# Altium project modFOC-MCU.PrjPcb
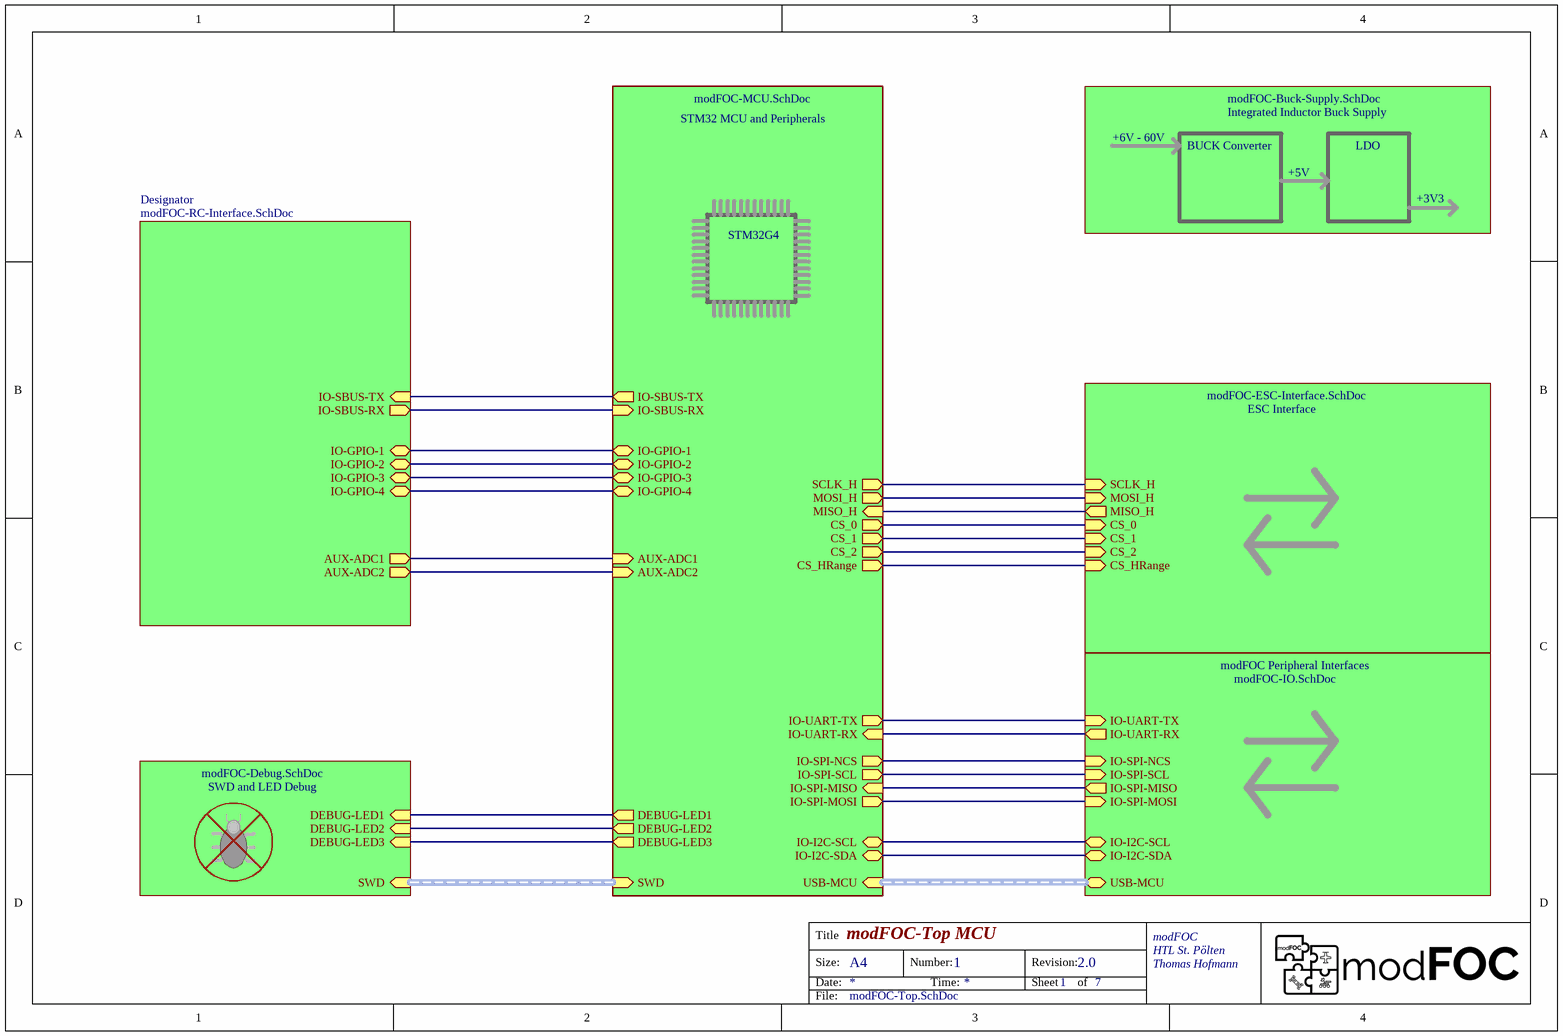
[diagram p0: modFOC-Top.SchDoc]
7 sheets, 106 parts. Net scope: hierarchical (ports join the sheet entries above them; power ports are global).
Board file: modFOC-MCU.PcbDoc
Sheets:
  modFOC-Top.SchDoc
    modFOC Peripheral Interfaces = modFOC-IO.SchDoc
    STM32 MCU and Peripherals = modFOC-MCU.SchDoc
    Integrated Inductor Buck Supply = modFOC-Buck-Supply.SchDoc
    SWD and LED Debug = modFOC-Debug.SchDoc
    ESC Interface = modFOC-ESC-Interface.SchDoc
    Designator = modFOC-RC-Interface.SchDoc

## Sheet modFOC-Top.SchDoc: modFOC-Top MCU
size A4; Author: Thomas Hofmann; CompanyName: HTL St. Pölten; Organization: Altium Limited; Address1: modFOC; Address2: Frenchs Forest; Address3: NSW; Address4: Australia 2086; DocumentNumber: 1; Revision: 2.0; SheetNumber: 1; SheetTotal: 7

### Sub-sheets
Designator = modFOC-RC-Interface.SchDoc: IO-SBUS-TX (in), IO-SBUS-RX (out), IO-GPIO-1 (bidir), AUX-ADC2 (out), IO-GPIO-4 (bidir), AUX-ADC1 (out), IO-GPIO-3 (bidir), IO-GPIO-2 (bidir)
ESC Interface = modFOC-ESC-Interface.SchDoc: SCLK_H (in), MOSI_H (in), MISO_H (out), CS_0 (in), CS_1 (in), CS_2 (in), CS_HRange (in)
Integrated Inductor Buck Supply = modFOC-Buck-Supply.SchDoc: no entries
modFOC Peripheral Interfaces = modFOC-IO.SchDoc: USB-MCU (bidir, harness USB-HARNESS), IO-I2C-SDA (bidir), IO-I2C-SCL (bidir), IO-SPI-MOSI (in), IO-SPI-MISO (out), IO-SPI-SCL (in), IO-SPI-NCS (in), IO-UART-RX (out), IO-UART-TX (in)
STM32 MCU and Peripherals = modFOC-MCU.SchDoc: USB-MCU (in, harness USB-HARNESS), SWD (in, harness SWD-HARNESS), DEBUG-LED3 (out), DEBUG-LED2 (out), DEBUG-LED1 (out), IO-I2C-SDA (bidir), IO-I2C-SCL (bidir), IO-SPI-MOSI (out), IO-SPI-MISO (in), IO-SPI-SCL (out), IO-SPI-NCS (out), IO-UART-RX (in), IO-UART-TX (out), SCLK_H (out), MOSI_H (out), MISO_H (in), CS_0 (out), CS_1 (out), CS_2 (out), CS_HRange (out), IO-SBUS-TX (out), IO-SBUS-RX (in), IO-GPIO-1 (bidir), AUX-ADC2 (in), IO-GPIO-4 (bidir), AUX-ADC1 (in), IO-GPIO-3 (bidir), IO-GPIO-2 (bidir)
SWD and LED Debug = modFOC-Debug.SchDoc: SWD (in, harness SWD-HARNESS), DEBUG-LED3 (in), DEBUG-LED2 (in), DEBUG-LED1 (in)

### Nets
AUX-ADC1: sheet STM32 MCU and Peripherals/AUX-ADC1, sheet Designator/AUX-ADC1
AUX-ADC2: sheet STM32 MCU and Peripherals/AUX-ADC2, sheet Designator/AUX-ADC2
CS_0: sheet STM32 MCU and Peripherals/CS_0, sheet ESC Interface/CS_0
CS_1: sheet STM32 MCU and Peripherals/CS_1, sheet ESC Interface/CS_1
CS_2: sheet STM32 MCU and Peripherals/CS_2, sheet ESC Interface/CS_2
CS_HRange: sheet STM32 MCU and Peripherals/CS_HRange, sheet ESC Interface/CS_HRange
DEBUG-LED1: sheet STM32 MCU and Peripherals/DEBUG-LED1, sheet SWD and LED Debug/DEBUG-LED1
DEBUG-LED2: sheet STM32 MCU and Peripherals/DEBUG-LED2, sheet SWD and LED Debug/DEBUG-LED2
DEBUG-LED3: sheet STM32 MCU and Peripherals/DEBUG-LED3, sheet SWD and LED Debug/DEBUG-LED3
IO-GPIO-1: sheet STM32 MCU and Peripherals/IO-GPIO-1, sheet Designator/IO-GPIO-1
IO-GPIO-2: sheet STM32 MCU and Peripherals/IO-GPIO-2, sheet Designator/IO-GPIO-2
IO-GPIO-3: sheet STM32 MCU and Peripherals/IO-GPIO-3, sheet Designator/IO-GPIO-3
IO-GPIO-4: sheet STM32 MCU and Peripherals/IO-GPIO-4, sheet Designator/IO-GPIO-4
IO-I2C-SCL: sheet modFOC Peripheral Interfaces/IO-I2C-SCL, sheet STM32 MCU and Peripherals/IO-I2C-SCL
IO-I2C-SDA: sheet modFOC Peripheral Interfaces/IO-I2C-SDA, sheet STM32 MCU and Peripherals/IO-I2C-SDA
IO-SBUS-RX: sheet STM32 MCU and Peripherals/IO-SBUS-RX, sheet Designator/IO-SBUS-RX
IO-SBUS-TX: sheet STM32 MCU and Peripherals/IO-SBUS-TX, sheet Designator/IO-SBUS-TX
IO-SPI-MISO: sheet modFOC Peripheral Interfaces/IO-SPI-MISO, sheet STM32 MCU and Peripherals/IO-SPI-MISO
IO-SPI-MOSI: sheet modFOC Peripheral Interfaces/IO-SPI-MOSI, sheet STM32 MCU and Peripherals/IO-SPI-MOSI
IO-SPI-NCS: sheet modFOC Peripheral Interfaces/IO-SPI-NCS, sheet STM32 MCU and Peripherals/IO-SPI-NCS
IO-SPI-SCL: sheet modFOC Peripheral Interfaces/IO-SPI-SCL, sheet STM32 MCU and Peripherals/IO-SPI-SCL
IO-UART-RX: sheet modFOC Peripheral Interfaces/IO-UART-RX, sheet STM32 MCU and Peripherals/IO-UART-RX
IO-UART-TX: sheet modFOC Peripheral Interfaces/IO-UART-TX, sheet STM32 MCU and Peripherals/IO-UART-TX
MISO_H: sheet STM32 MCU and Peripherals/MISO_H, sheet ESC Interface/MISO_H
MOSI_H: sheet STM32 MCU and Peripherals/MOSI_H, sheet ESC Interface/MOSI_H
SCLK_H: sheet STM32 MCU and Peripherals/SCLK_H, sheet ESC Interface/SCLK_H

### Buses and harness runs
harness sheet modFOC Peripheral Interfaces/USB-MCU = sheet STM32 MCU and Peripherals/USB-MCU
harness sheet STM32 MCU and Peripherals/SWD = sheet SWD and LED Debug/SWD

### Notes on the sheet
- +6V - 60V
- BUCK Converter
- +5V
- LDO
- STM32G4
- +3V3
- Title
- Size:
- Date:
- A4
- Number:
- Time:
- Revision:
- Sheet
- of
- File:

## Sheet modFOC-IO.SchDoc: modFOC-IO
size A4; Author: Thomas Hofmann; CompanyName: HTL St. Pölten; Organization: Altium Limited; Address1: modFOC; Address2: Frenchs Forest; Address3: NSW; Address4: Australia 2086; DocumentNumber: 5; Revision: 2.0; SheetNumber: 5; SheetTotal: 7
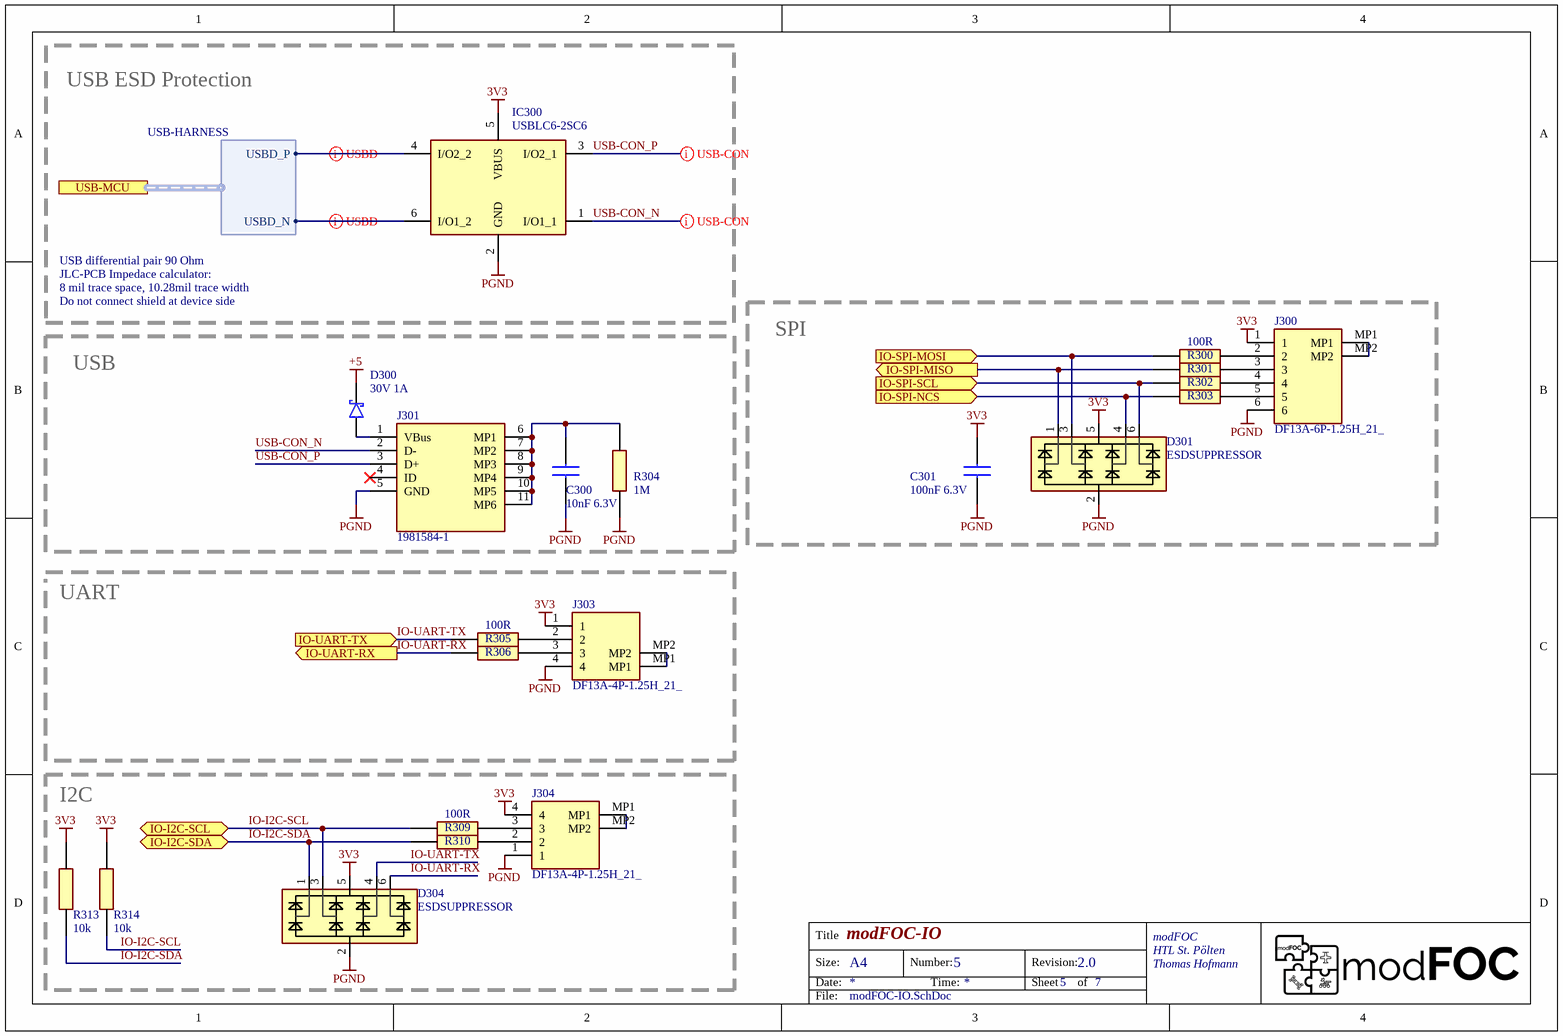
[diagram p1: modFOC-IO.SchDoc]

### Parts
C300  10nF 6.3V  [CAPC1608X97N]
C301  100nF 6.3V  [CAPC1608X97N]
D300  30V 1A  [SOD-323]
D301  ESDSUPPRESSOR  [SOT23-6]
D304  ESDSUPPRESSOR  [SOT23-6]
IC300  USBLC6-2SC6  [SOT95P280X145-6N]
J300  DF13A-6P-1.25H_21_  [DF13A6P125H21]
J301  1981584-1  [19815841]
J303  DF13A-4P-1.25H_21_  [DF13A4P125H21]
J304  DF13A-4P-1.25H_21_  [DF13A4P125H21]
R300  100R  [RESC1005X40N]
R301  100R  [RESC1005X40N]  (value not drawn)
R302  100R  [RESC1005X40N]  (value not drawn)
R303  100R  [RESC1005X40N]  (value not drawn)
R304  1M  [RESC1608X50N]
R305  100R  [RESC1005X40N]
R306  100R  [RESC1005X40N]  (value not drawn)
R309  100R  [RESC1005X40N]
R310  100R  [RESC1005X40N]  (value not drawn)
R313  10k  [RESC1608X50N]
R314  10k  [RESC1608X50N]

### Blocks framed on the sheet
SPI: C301 D301 J300 R300-R303
USB: C300 D300 J301 R304
I2C: D304 J304 R309 R310 R313 R314

### Ports
IO-I2C-SCL (bidir), IO-I2C-SDA (bidir), IO-SPI-MISO (out), IO-SPI-MOSI (in), IO-SPI-NCS (in), IO-SPI-SCL (in), IO-UART-RX (out), IO-UART-TX (in), USB-MCU (harness USB-HARNESS)

### Harnesses
USB-HARNESS: USBD_P, USBD_N

### Nets
3V3: C301.2 D301.5(VDD) D304.5(VDD) IC300.5(VBUS) J300.1 J303.1 J304.4 R313.1 R314.1
+5: D300.1(K)
PGND: C300.1 C301.1 D301.2(GND) D304.2(GND) IC300.2(GND) J300.6 J301.5(GND) J303.4 J304.1 R304.1
IO-I2C-SCL: D304.3(CH2) R309.1 R314.2 ; port IO-I2C-SCL
IO-I2C-SDA: D304.1(CH1) R310.1 R313.2 ; port IO-I2C-SDA
IO-SPI-MISO: D301.1(CH1) R301.1 ; port IO-SPI-MISO
IO-SPI-MOSI: D301.3(CH2) R300.1 ; port IO-SPI-MOSI
IO-SPI-NCS: D301.4(CH3) R303.1 ; port IO-SPI-NCS
IO-SPI-SCL: D301.6(CH4) R302.1 ; port IO-SPI-SCL
IO-UART-RX: D304.6(CH4) R306.1 ; port IO-UART-RX
IO-UART-TX: D304.4(CH3) R305.1 ; port IO-UART-TX
USB-CON_N: IC300.1(I/O1_1) J301.2(D-)
USB-CON_P: IC300.3(I/O2_1) J301.3(D+)
NetC300_2: C300.2 J301.6(MP1) J301.7(MP2) J301.8(MP3) J301.9(MP4) J301.10(MP5) J301.11(MP6) R304.2
NetD300_2: D300.2(A) J301.1(VBus)
NetIC300_4: IC300.4(I/O2_2) ; port USB-MCU.USBD_P
NetIC300_6: IC300.6(I/O1_2) ; port USB-MCU.USBD_N
NetJ300_2: J300.2 R300.2
NetJ300_3: J300.3 R301.2
NetJ300_4: J300.4 R302.2
NetJ300_5: J300.5 R303.2
NetJ300_MP1: J300.MP1 J300.MP2
NetJ303_2: J303.2 R305.2
NetJ303_3: J303.3 R306.2
NetJ303_MP1: J303.MP1 J303.MP2
NetJ304_2: J304.2 R310.2
NetJ304_3: J304.3 R309.2
NetJ304_MP1: J304.MP1 J304.MP2

Not connected (* = marked no-connect by the designer): J301 4(ID)*

### Layout directives
differential pair: NetIC300_4, NetIC300_6, USB-CON_N, USB-CON_P

### Notes on the sheet
- USB ESD Protection
- USB differential pair 90 Ohm
- JLC-PCB Impedace calculator:
- Do not connect shield at device side
- 8 mil trace space, 10.28mil trace width
- UART
- Title
- Size:
- Date:
- A4
- Number:
- Time:
- Revision:
- Sheet
- of
- File:

### Library data of the parts
C300 C301 = C0603: Capacitor; Height: 0.97
D300 = SCHOTTKY-DIODE: Schottky Diode
D301 D304 = ESDSUPPRESSOR: TVS Diode Array; Height: 0.6mm
IC300 = USBLC6-2SC6: Integrated Circuit; Manufacturer_Name: STMicroelectronics; Datasheet Link: http://www.st.com/st-web-ui/static/active/en/resource/technical/document/datasheet/CD00050750.pdf; Height: 1.45mm; Manufacturer_Part_Number: USBLC6-2SC6; Arrow Part Number: USBLC6-2SC6; Arrow Price/Stock: https://www.arrow.com/en/products/usblc6-2sc6/stmicroelectronics; Mouser Part Number: 511-USBLC6-2SC6; Mouser Price/Stock: https://www.mouser.co.uk/ProductDetail/STMicroelectronics/USBLC6-2SC6?qs=po45yt2pPpu%2FhNIlwQdTlg%3D%3D
J300 = DF13A-6P-1.25H_21_: Connector; Manufacturer_Name: Hirose; Manufacturer_Part_Number: DF13A-6P-1.25H(21); Datasheet Link: https://www.hirose.com/product/download/?distributor=digikey&type=2d&lang=en&num=DF13A-6P-1.25H(21); Height: 3.75mm; Mouser Part Number: 798-DF13A6P125H21; Mouser Price/Stock: https://www.mouser.co.uk/ProductDetail/Hirose-Connector/DF13A-6P-125H21?qs=XQjbzJWzFPXnreVi%252BPl0Lg%3D%3D; Arrow Part Number: DF13A-6P-1.25H(21); Arrow Price/Stock: https://www.arrow.com/en/products/df13a-6p-1.25h-21/hirose-electric
J301 = 1981584-1: Connector; Manufacturer_Name: TE Connectivity; Datasheet Link: http://www.te.com/commerce/DocumentDelivery/DDEController?Action=showdoc&DocId=Customer+Drawing%7F1981584%7FD2%7Fpdf%7FEnglish%7FENG_CD_1981584_D2.pdf%7F1981584-1; Height: 3mm; Manufacturer_Part_Number: 1981584-1; Arrow Part Number: 1981584-1; Arrow Price/Stock: https://www.arrow.com/en/products/1981584-1/te-connectivity; Mouser Part Number: 571-1981584-1; Mouser Price/Stock: https://www.mouser.co.uk/ProductDetail/TE-Connectivity/1981584-1?qs=ozkTL%2FUej0TLYxjQLPnd2Q%3D%3D
J303 J304 = DF13A-4P-1.25H_21_: Connector; Manufacturer_Name: Hirose; Manufacturer_Part_Number: DF13A-4P-1.25H(21); Datasheet Link: https://componentsearchengine.com/Datasheets/1/DF13A-4P-1.25H(21).pdf; Height: 3.6mm; Mouser Part Number: 798-DF13A4P125H21; Mouser Price/Stock: https://www.mouser.co.uk/ProductDetail/Hirose-Connector/DF13A-4P-125H21?qs=XQjbzJWzFPXWzMShI70F0w%3D%3D
R300-R303 R305 R306 R309 R310 = R0402: Resistor; Height: 0.4mm
R304 R313 R314 = R0603: Resistor; Height: 0.55mm

## Sheet modFOC-MCU.SchDoc: modFOC-MCU
size A4; Author: Thomas Hofmann; CompanyName: HTL St.Pölten; Organization: Altium Limited; Address1: modFOC; Address4: Australia 2086; DocumentNumber: 1; Revision: 2.0; SheetNumber: 6; SheetTotal: 7
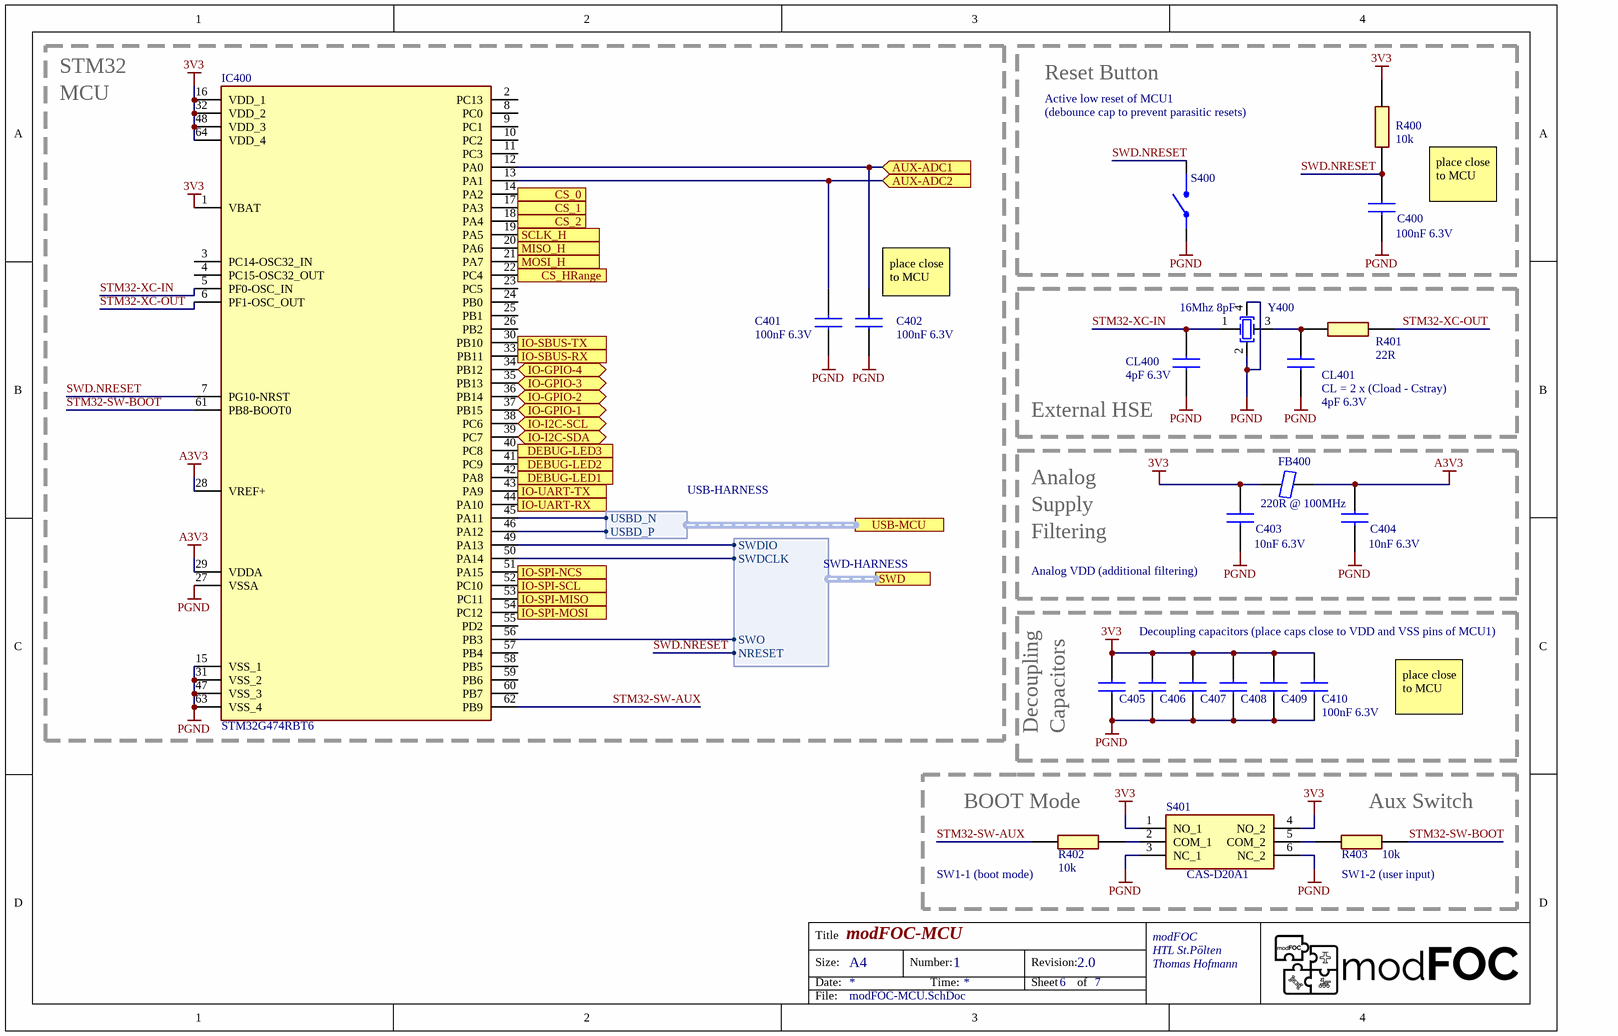
[diagram p2: modFOC-MCU.SchDoc]

### Parts
C400  100nF 6.3V  [CAPC1608X97N]
C401  100nF 6.3V  [CAPC1005X55N]
C402  100nF 6.3V  [CAPC1005X55N]
C403  10nF 6.3V  [CAPC1608X97N]
C404  10nF 6.3V  [CAPC1608X97N]
C405  100nF 6.3V  [CAPC1608X97N]  (value not drawn)
C406  100nF 6.3V  [CAPC1608X97N]  (value not drawn)
C407  100nF 6.3V  [CAPC1608X97N]  (value not drawn)
C408  100nF 6.3V  [CAPC1608X97N]  (value not drawn)
C409  100nF 6.3V  [CAPC1608X97N]  (value not drawn)
C410  100nF 6.3V  [CAPC1608X97N]
CL400  4pF 6.3V  [CAPC1608X97N]
CL401  4pF 6.3V  [CAPC1608X97N]
FB400  220R @ 100MHz  [FB0603]
IC400  STM32G474RBT6  [QFP50P1200X1200X160-64N]
R400  10k  [RESC1608X50N]
R401  22R  [RESC1005X40N]
R402  10k  [RESC1608X50N]
R403  10k  [RESC1608X50N]
S400  434153017835  [434153017835]  (value not drawn)
S401  CAS-D20A1  [CASD20A1]
Y400  16Mhz 8pF  [ABM8W160000MHZ8B1UT3]

### Blocks framed on the sheet
Reset Button: C400 R400 S400
External HSE: CL400 CL401 R401 Y400

### Ports
AUX-ADC1 (in), AUX-ADC2 (in), CS_0 (out), CS_1 (out), CS_2 (out), CS_HRange (out), DEBUG-LED1 (out), DEBUG-LED2 (out), DEBUG-LED3 (out), IO-GPIO-1 (bidir), IO-GPIO-2 (bidir), IO-GPIO-3 (bidir), IO-GPIO-4 (bidir), IO-I2C-SCL (bidir), IO-I2C-SDA (bidir), IO-SBUS-RX (in), IO-SBUS-TX (out), IO-SPI-MISO (in), IO-SPI-MOSI (out), IO-SPI-NCS (out), IO-SPI-SCL (out), IO-UART-RX (in), IO-UART-TX (out), MISO_H (in), MOSI_H (out), SCLK_H (out), SWD (harness SWD-HARNESS), USB-MCU (harness USB-HARNESS)

### Harnesses
USB-HARNESS: USBD_P, USBD_N
SWD-HARNESS: SWDIO, SWDCLK, SWO, NRESET

### Nets
3V3: C403.1 C405.1 C406.1 C407.1 C408.1 C409.1 C410.1 FB400.1 IC400.1(VBAT) IC400.16(VDD_1) IC400.32(VDD_2) IC400.48(VDD_3) IC400.64(VDD_4) R400.1 S401.1(NO_1) S401.4(NO_2)
A3V3: C404.1 FB400.2 IC400.28(VREF+) IC400.29(VDDA)
PGND: C400.2 C401.1 C402.1 C403.2 C404.2 C405.2 C406.2 C407.2 C408.2 C409.2 C410.2 CL400.1 CL401.1 IC400.15(VSS_1) IC400.27(VSSA) IC400.31(VSS_2) IC400.47(VSS_3) IC400.63(VSS_4) S400.1,4(NO) S401.3(NC_1) S401.6(NC_2) Y400.2(OSC2) Y400.4
AUX-ADC1: C402.2 IC400.12(PA0) ; port AUX-ADC1
AUX-ADC2: C401.2 IC400.13(PA1) ; port AUX-ADC2
CS_0: IC400.14(PA2) ; port CS_0
CS_1: IC400.17(PA3) ; port CS_1
CS_2: IC400.18(PA4) ; port CS_2
CS_HRange: IC400.22(PC4) ; port CS_HRange
DEBUG-LED1: IC400.42(PA8) ; port DEBUG-LED1
DEBUG-LED2: IC400.41(PC9) ; port DEBUG-LED2
DEBUG-LED3: IC400.40(PC8) ; port DEBUG-LED3
IO-GPIO-1: IC400.37(PB15) ; port IO-GPIO-1
IO-GPIO-2: IC400.36(PB14) ; port IO-GPIO-2
IO-GPIO-3: IC400.35(PB13) ; port IO-GPIO-3
IO-GPIO-4: IC400.34(PB12) ; port IO-GPIO-4
IO-I2C-SCL: IC400.38(PC6) ; port IO-I2C-SCL
IO-I2C-SDA: IC400.39(PC7) ; port IO-I2C-SDA
IO-SBUS-RX: IC400.33(PB11) ; port IO-SBUS-RX
IO-SBUS-TX: IC400.30(PB10) ; port IO-SBUS-TX
IO-SPI-MISO: IC400.53(PC11) ; port IO-SPI-MISO
IO-SPI-MOSI: IC400.54(PC12) ; port IO-SPI-MOSI
IO-SPI-NCS: IC400.51(PA15) ; port IO-SPI-NCS
IO-SPI-SCL: IC400.52(PC10) ; port IO-SPI-SCL
IO-UART-RX: IC400.44(PA10) ; port IO-UART-RX
IO-UART-TX: IC400.43(PA9) ; port IO-UART-TX
MISO_H: IC400.20(PA6) ; port MISO_H
MOSI_H: IC400.21(PA7) ; port MOSI_H
SCLK_H: IC400.19(PA5) ; port SCLK_H
STM32-SW-AUX: IC400.62(PB9) R402.2
STM32-SW-BOOT: IC400.61(PB8-BOOT0) R403.2
STM32-XC-IN: CL400.2 IC400.5(PF0-OSC_IN) Y400.1(OSC1)
STM32-XC-OUT: IC400.6(PF1-OSC_OUT) R401.2
SWD.NRESET: C400.1 IC400.7(PG10-NRST) R400.2 S400.2,3(COM) ; port SWD.NRESET
NetCL401_2: CL401.2 R401.1 Y400.3
NetD200_1: IC400.49(PA13) ; port SWD.SWDIO
NetD200_3: IC400.50(PA14) ; port SWD.SWDCLK
NetD200_4: IC400.56(PB3) ; port SWD.SWO
NetIC300_4: IC400.46(PA12) ; port USB-MCU.USBD_P
NetIC300_6: IC400.45(PA11) ; port USB-MCU.USBD_N
NetR402_1: R402.1 S401.2(COM_1)
NetR403_1: R403.1 S401.5(COM_2)

Not connected (* = marked no-connect by the designer): IC400 2(PC13) 3(PC14-OSC32_IN) 4(PC15-OSC32_OUT) 8(PC0) 9(PC1) 10(PC2) 11(PC3) 23(PC5) 24(PB0) 25(PB1) 26(PB2) 55(PD2) 57(PB4) 58(PB5) 59(PB6) 60(PB7)

### Notes on the sheet
- STM32
- MCU
- Active low reset of MCU1
- (debounce cap to prevent parasitic resets)
- place close to MCU
- (near C402) place close to MCU
- (near CL401) CL = 2 x (Cload - Cstray)
- Analog
- Supply
- (near C403) Analog VDD (additional filtering)
- Filtering
- Decoupling capacitors (place caps close to VDD and VSS pins of MCU1)
- Decoupling
- (near C405) Capacitors
- (near R402) BOOT Mode
- (near R403) Aux Switch
- (near R402) SW1-1 (boot mode)
- (near R403) SW1-2 (user input)
- Title
- Size:
- Date:
- A4
- Number:
- Time:
- Revision:
- Sheet
- of
- File:

### Library data of the parts
C400 C403-C410 CL400 CL401 = C0603: Capacitor; Height: 0.97
C401 C402 = C0402: Capacitor
FB400 = FB0603: Ferrite Bead; Height: 0.75mm
IC400 = STM32G474RBT6: Integrated Circuit; Manufacturer_Name: STMicroelectronics; Datasheet Link: https://www.mouser.com/datasheet/2/389/stm32g474cb-1600828.pdf; Height: 1.6mm; Manufacturer_Part_Number: STM32G474RBT6; Mouser Part Number: 511-STM32G474RBT6; Mouser Price/Stock: https://www.mouser.co.uk/ProductDetail/STMicroelectronics/STM32G474RBT6?qs=uwxL4vQweFP0uAZUZXLBhQ%3D%3D
R400 R402 R403 = R0603: Resistor; Height: 0.55mm
R401 = R0402: Resistor; Height: 0.4mm
S400 = SW-SPST: Switch
S401 = CAS-D20A1: Switch; Manufacturer_Name: Copal Electronics; Datasheet Link: https://www.nidec-copal-electronics.com/e/catalog/switch/cas.pdf; Height: 2.5mm; Manufacturer_Part_Number: CAS-D20A1
Y400 = ABM8W-16.0000MHZ-8-B1U-T3: Crystal or Oscillator; Manufacturer_Name: ABRACON; Datasheet Link: https://abracon.com/Resonators/ABM8W.pdf; Height: 0.75mm; Manufacturer_Part_Number: ABM8W-16.0000MHZ-8-B1U-T3; Mouser Part Number: 815-8W16-8B1UT; Mouser Price/Stock: https://www.mouser.co.uk/ProductDetail/ABRACON/ABM8W-160000MHZ-8-B1U-T3?qs=5aG0NVq1C4zuwTHNFUIcqw%3D%3D; Arrow Part Number: ABM8W-16.0000MHZ-8-B1U-T3; Arrow Price/Stock: https://www.arrow.com/en/products/abm8w-16.0000mhz-8-b1u-t3/abracon

## Sheet modFOC-Buck-Supply.SchDoc: modFOC-Buck-Supply
size A4; Author: Thomas Hofmann; CompanyName: HTL St. Pölten; Organization: Altium Limited; Address1: modFOC; Address2: Frenchs Forest; Address3: NSW; Address4: Australia 2086; DocumentNumber: 2; Revision: 2.0; SheetNumber: 3; SheetTotal: 7
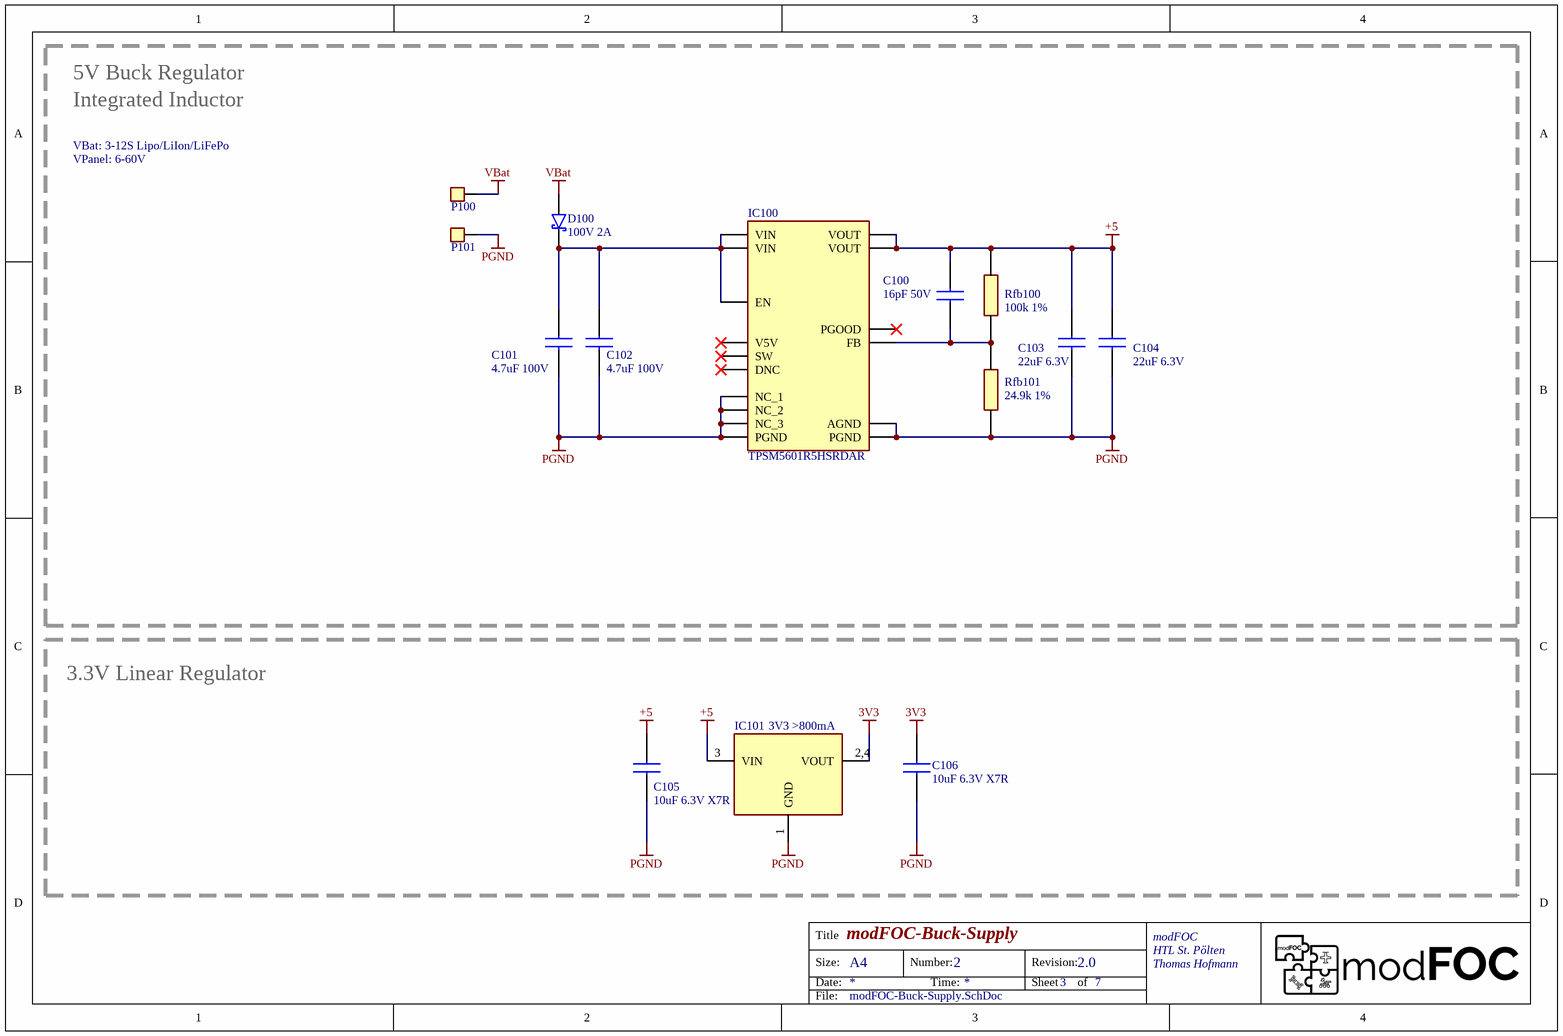
[diagram p3: modFOC-Buck-Supply.SchDoc]

### Parts
C100  16pF 50V  [CAPC1608X97N]
C101  4.7uF 100V  [CAPC3225X270N]
C102  4.7uF 100V  [CAPC3225X270N]
C103  22uF 6.3V  [CAPC3225X270N]
C104  22uF 6.3V  [CAPC3225X270N]
C105  10uF 6.3V X7R  [CAPC3216X180N]
C106  10uF 6.3V X7R  [CAPC3216X180N]
D100  100V 2A  [SOD-123FL]
IC100  TPSM5601R5HSRDAR  [TPSM5601R5HSRDAR]
IC101  3V3 >800mA  [SOT230P700X180-4N]
P100  PowerPad  [POWER_PAD_S]  (value not drawn)
P101  PowerPad  [POWER_PAD_S]  (value not drawn)
Rfb100  100k 1%  [RESC1608X50N]
Rfb101  24.9k 1%  [RESC1608X50N]

### Blocks framed on the sheet
3.3V Linear Regulator: C105 C106 IC101

### Nets
3V3: C106.2 IC101.2,4(VOUT)
+5: C100.2 C103.2 C104.2 C105.2 IC100.7(VOUT) IC100.8(VOUT) IC101.3(VIN) Rfb100.2
PGND: C101.1 C102.1 C103.1 C104.1 C105.1 C106.1 IC100.3(NC_1) IC100.6(NC_2) IC100.10(AGND) IC100.13(NC_3) IC100.15,_16(PGND) IC100.17(PGND) IC101.1(GND) P101.1 Rfb101.1
VBat: D100.2(A) P100.1
NetC100_1: C100.1 IC100.9(FB) Rfb100.1 Rfb101.2
NetC101_2: C101.2 C102.2 D100.1(K) IC100.1(VIN) IC100.2(EN) IC100.14(VIN)

Not connected (* = marked no-connect by the designer): IC100 4(SW)* 5(DNC)* 11(V5V)* 12(PGOOD)*

### Notes on the sheet
- 5V Buck Regulator
- Integrated Inductor
- VBat: 3-12S Lipo/LiIon/LiFePo
- VPanel: 6-60V
- Title
- Size:
- Date:
- A4
- Number:
- Time:
- Revision:
- Sheet
- of
- File:

### Library data of the parts
C100 = C0603: Capacitor; Height: 0.97
C101-C104 = C1210: Capacitor; Height: 0.97mm
C105 C106 = C1206: Capacitor; Height: 1.8mm
D100 = SCHOTTKY-DIODE: Schottky Diode
IC100 = TPSM5601R5HSRDAR: Integrated Circuit; pin to pad: 15, 16>15+16; Manufacturer_Name: Texas Instruments; Datasheet Link: https://www.ti.com/lit/ds/symlink/tpsm5601r5h.pdf?ts=1622688238120&ref_url=https%253A%252F%252Fcomponentsearchengine.com%252F; Height: 4.1mm; Manufacturer_Part_Number: TPSM5601R5HSRDAR; Mouser Part Number: 595-TPSM5601R5HSRDAR; Mouser Price/Stock: https://www.mouser.co.uk/ProductDetail/Texas-Instruments/TPSM5601R5HSRDAR?qs=DRkmTr78QARQPwPAx4O%252BKQ%3D%3D; Arrow Part Number: TPSM5601R5HSRDAR; Arrow Price/Stock: https://www.arrow.com/en/products/tpsm5601r5hsrdar/texas-instruments?region=nac
IC101 = LDO-SOT223: LDO
Rfb100 Rfb101 = R0603: Resistor; Height: 0.55mm

## Sheet modFOC-Debug.SchDoc: modFOC-Debug
size A4; Author: Thomas Hofmann; CompanyName: HTL St. Pölten; Organization: Altium Limited; Address1: modFOC; Address2: Frenchs Forest; Address3: NSW; Address4: Australia 2086; DocumentNumber: 6; Revision: 2.0; SheetNumber: 4; SheetTotal: 7
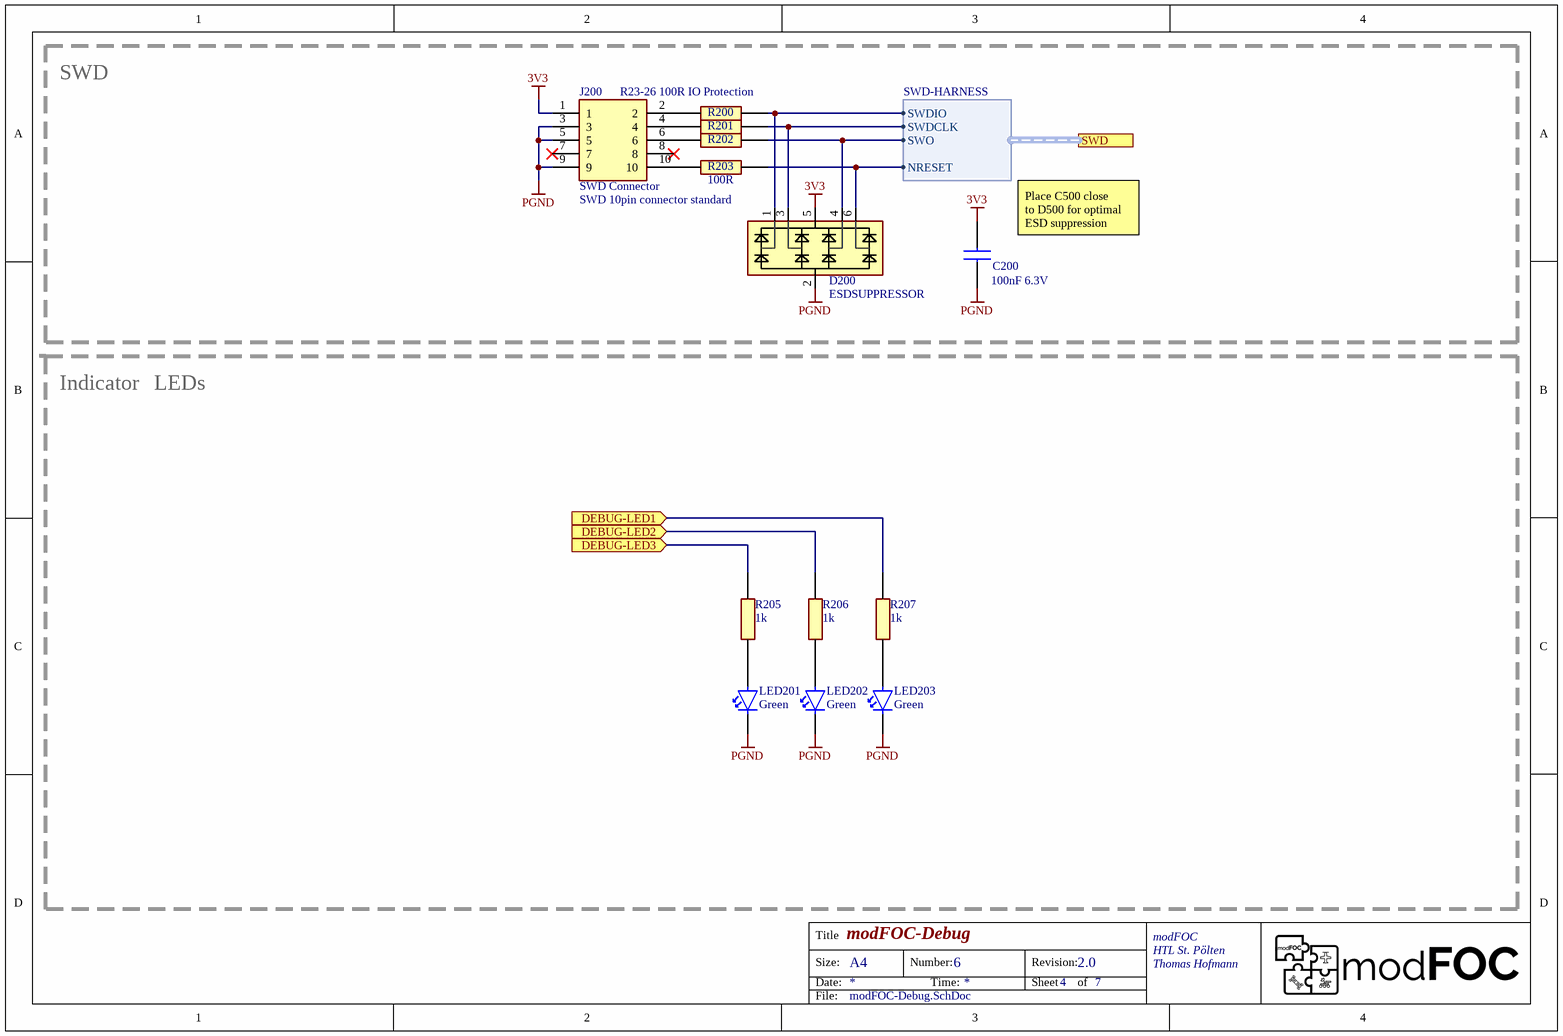
[diagram p4: modFOC-Debug.SchDoc]

### Parts
C200  100nF 6.3V  [CAPC1608X97N]
D200  ESDSUPPRESSOR  [SOT23-6]
J200  SWD Connector  [HUSSP10W40P127_2X5_635X340X420P]
LED201  Green  [CHIPLED_0603]
LED202  Green  [CHIPLED_0603]
LED203  Green  [CHIPLED_0603]
R200  100R  [RESC1005X40N]  (value not drawn)
R201  100R  [RESC1005X40N]  (value not drawn)
R202  100R  [RESC1005X40N]  (value not drawn)
R203  100R  [RESC1005X40N]
R205  1k  [RESC1608X50N]
R206  1k  [RESC1608X50N]
R207  1k  [RESC1608X50N]

### Blocks framed on the sheet
SWD: C200 D200 J200 R200-R203

### Ports
DEBUG-LED1 (in), DEBUG-LED2 (in), DEBUG-LED3 (in), SWD (harness SWD-HARNESS)

### Harnesses
SWD-HARNESS: SWDIO, SWDCLK, SWO, NRESET

### Nets
3V3: C200.2 D200.5(VDD) J200.1
PGND: C200.1 D200.2(GND) J200.3 J200.5 J200.9 LED201.1(K) LED202.1(K) LED203.1(K)
DEBUG-LED1: R207.1 ; port DEBUG-LED1
DEBUG-LED2: R206.1 ; port DEBUG-LED2
DEBUG-LED3: R205.1 ; port DEBUG-LED3
SWD.NRESET: D200.6(CH4) R203.2 ; port SWD.NRESET
NetD200_1: D200.1(CH1) R200.2 ; port SWD.SWDIO
NetD200_3: D200.3(CH2) R201.2 ; port SWD.SWDCLK
NetD200_4: D200.4(CH3) R202.2 ; port SWD.SWO
NetJ200_2: J200.2 R200.1
NetJ200_4: J200.4 R201.1
NetJ200_6: J200.6 R202.1
NetJ200_10: J200.10 R203.1
NetLED201_2: LED201.2(A) R205.2
NetLED202_2: LED202.2(A) R206.2
NetLED203_2: LED203.2(A) R207.2

Not connected (* = marked no-connect by the designer): J200 7* 8*

### Notes on the sheet
- R23-26 100R IO Protection
- SWD 10pin connector standard
- (near C200) Place C500 close
  to D500 for optimal
  ESD suppression
- Indicator
- LEDs
- Title
- Size:
- Date:
- A4
- Number:
- Time:
- Revision:
- Sheet
- of
- File:

### Library data of the parts
C200 = C0603: Capacitor; Height: 0.97
D200 = ESDSUPPRESSOR: TVS Diode Array; Height: 0.6mm
J200 = M50-3600542R: Connector; Manufacturer_Name: Harwin; Datasheet Link: https://cdn.harwin.com/pdfs/M50-360R.pdf; Manufacturer_Part_Number: M50-3600542R; Mouser Part Number: 855-M50-3600542R; Mouser Price/Stock: https://www.mouser.co.uk/ProductDetail/Harwin/M50-3600542R?qs=DVxm2sPGGrrPu%2FxuhpV3yw%3D%3D
LED201-LED203 = CHIPLED0603: LED; Mouser Price/Stock: https://www.mouser.at/c/optoelectronics/led-lighting/led-emitters/standard-leds-smd/?series=CHIPLED%200603&instock=y
R200-R203 = R0402: Resistor; Height: 0.4mm
R205-R207 = R0603: Resistor; Height: 0.55mm

## Sheet modFOC-ESC-Interface.SchDoc: modFOC-ESC-Interface
size A4; Author: Thomas Hofmann; CompanyName: HTL St. Pölten; Organization: Altium Limited; Address1: modFOC; Address2: Frenchs Forest; Address3: NSW; Address4: Australia 2086; DocumentNumber: 8; Revision: 2.0; SheetNumber: 2; SheetTotal: 7
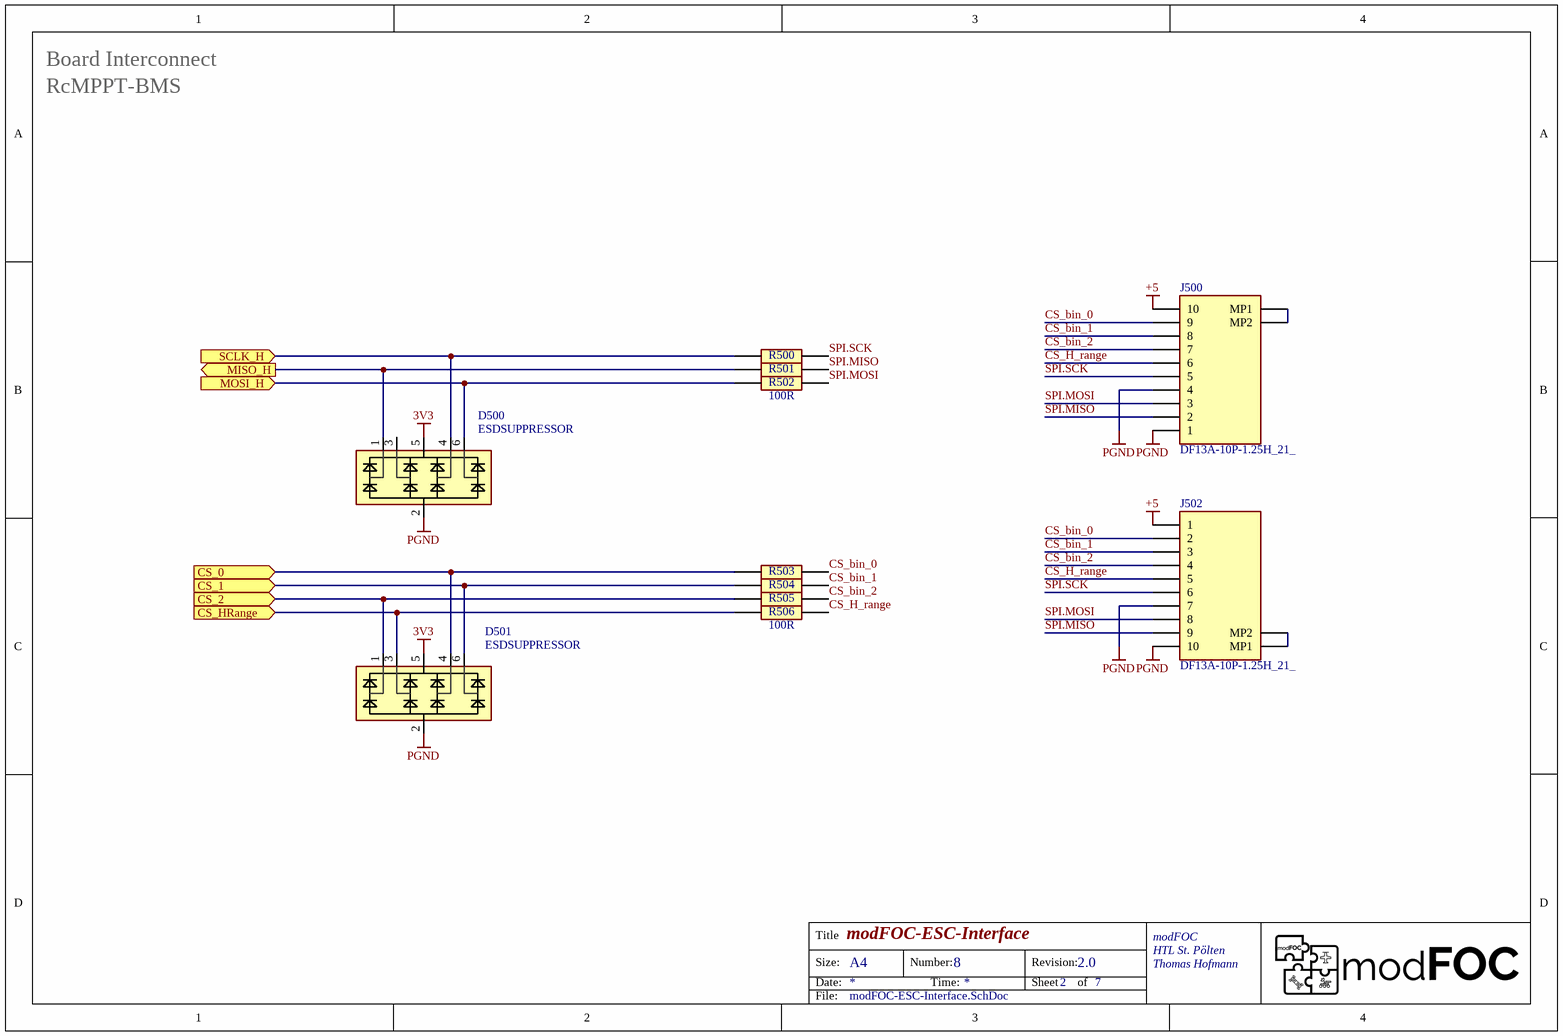
[diagram p5: modFOC-ESC-Interface.SchDoc]

### Parts
D500  ESDSUPPRESSOR  [SOT23-6]
D501  ESDSUPPRESSOR  [SOT23-6]
J500  DF13A-10P-1.25H_21_  [DF13A10P125H21]
J502  DF13A-10P-1.25H_21_  [DF13A10P125H21]
R500  100R  [RESC1005X40N]  (value not drawn)
R501  100R  [RESC1005X40N]  (value not drawn)
R502  100R  [RESC1005X40N]
R503  100R  [RESC1005X40N]  (value not drawn)
R504  100R  [RESC1005X40N]  (value not drawn)
R505  100R  [RESC1005X40N]  (value not drawn)
R506  100R  [RESC1005X40N]

### Ports
CS_0 (in), CS_1 (in), CS_2 (in), CS_HRange (in), MISO_H (out), MOSI_H (in), SCLK_H (in)

### Nets
3V3: D500.5(VDD) D501.5(VDD)
+5: J500.10 J502.1
PGND: D500.2(GND) D501.2(GND) J500.1 J500.4 J502.7 J502.10
CS_0: D501.4(CH3) R503.1 ; port CS_0
CS_1: D501.6(CH4) R504.1 ; port CS_1
CS_2: D501.1(CH1) R505.1 ; port CS_2
CS_bin_0: J500.9 J502.2 R503.2
CS_bin_1: J500.8 J502.3 R504.2
CS_bin_2: J500.7 J502.4 R505.2
CS_H_range: J500.6 J502.5 R506.2
CS_HRange: D501.3(CH2) R506.1 ; port CS_HRange
MISO_H: D500.1(CH1) R501.1 ; port MISO_H
MOSI_H: D500.6(CH4) R502.1 ; port MOSI_H
SCLK_H: D500.4(CH3) R500.1 ; port SCLK_H
SPI.MISO: J500.2 J502.9 R501.2
SPI.MOSI: J500.3 J502.8 R502.2
SPI.SCK: J500.5 J502.6 R500.2
NetJ500_MP1: J500.MP1 J500.MP2
NetJ502_MP1: J502.MP1 J502.MP2

Not connected (* = marked no-connect by the designer): D500 3(CH2)

### Notes on the sheet
- Board Interconnect
- RcMPPT-BMS
- Title
- Size:
- Date:
- A4
- Number:
- Time:
- Revision:
- Sheet
- of
- File:

### Library data of the parts
D500 D501 = ESDSUPPRESSOR: TVS Diode Array; Height: 0.6mm
J500 J502 = DF13A-10P-1.25H_21_: 10Pin DF13 Connector; Manufacturer_Name: Hirose; Manufacturer_Part_Number: DF13A-10P-1.25H(21); Datasheet Link: https://datasheet.datasheetarchive.com/originals/dk/DKDS-30/590349.pdf; Height: 3.75mm; Mouser Part Number: 798-DF13A10P125H21; Mouser Price/Stock: https://www.mouser.co.uk/ProductDetail/Hirose-Connector/DF13A-10P-125H21?qs=XQjbzJWzFPV7pEVOeMnY%2FQ%3D%3D; Arrow Part Number: DF13A-10P-1.25H(21); Arrow Price/Stock: https://www.arrow.com/en/products/df13a-10p-1.25h-21/hirose-electric
R500-R506 = R0402: Resistor; Height: 0.4mm

## Sheet modFOC-RC-Interface.SchDoc: modFOC-RC-Interface
size A4; Author: Thomas Hofmann; CompanyName: HTL St. Pölten; DrawnBy: Thomas Hofmann; Engineer: Thomas Hofmann; Organization: Altium Limited; Address1: modFOC; Address2: Frenchs Forest; Address3: NSW; Address4: Australia 2086; DocumentNumber: 7; Revision: 2.0; SheetNumber: 7; SheetTotal: 7
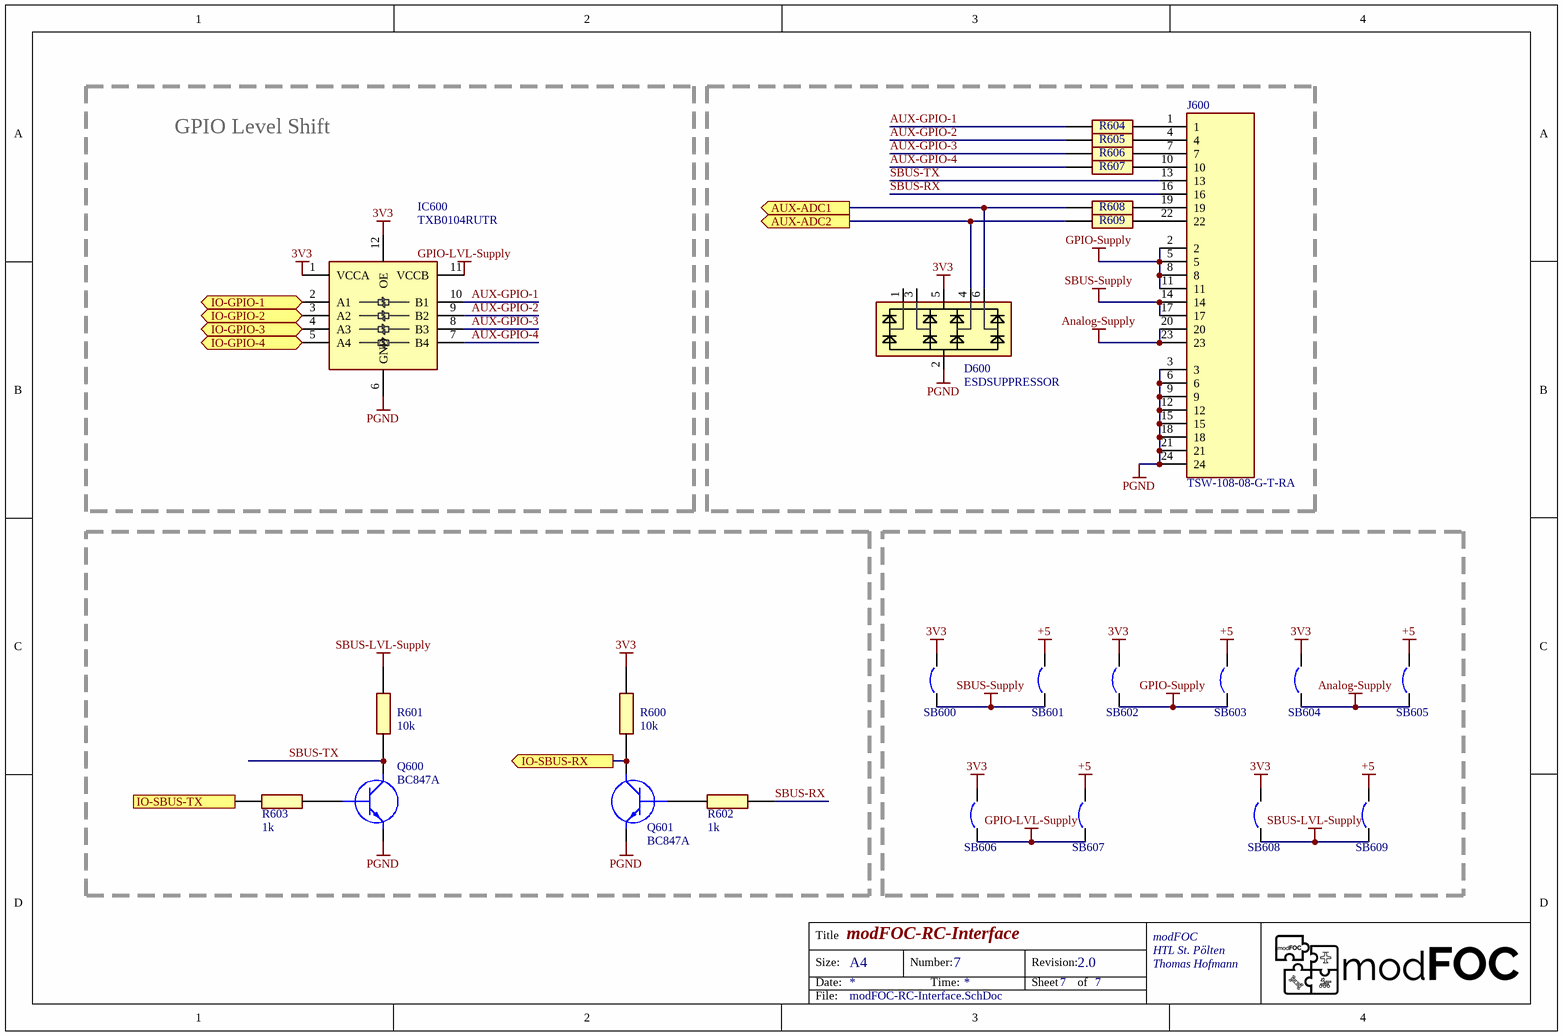
[diagram p6: modFOC-RC-Interface.SchDoc]

### Parts
D600  ESDSUPPRESSOR  [SOT23-6]
IC600  TXB0104RUTR  [TXB0104RUTR]
J600  TSW-108-08-G-T-RA  [HDRRA24W64P254_3X8_2032X254X812P]
Q600  BC847A  [SOT95P230X110-3N]
Q601  BC847A  [SOT95P230X110-3N]
R600  10k  [RESC1608X50N]
R601  10k  [RESC1608X50N]
R602  1k  [RESC1608X50N]
R603  1k  [RESC1608X50N]
R604  100R  [RESC1005X40N]  (value not drawn)
R605  100R  [RESC1005X40N]  (value not drawn)
R606  100R  [RESC1005X40N]  (value not drawn)
R607  100R  [RESC1005X40N]  (value not drawn)
R608  100R  [RESC1005X40N]  (value not drawn)
R609  100R  [RESC1005X40N]  (value not drawn)
SB600  Solder Bridge  [SB0402]  (value not drawn)
SB601  Solder Bridge  [SB0402]  (value not drawn)
SB602  Solder Bridge  [SB0402]  (value not drawn)
SB603  Solder Bridge  [SB0402]  (value not drawn)
SB604  Solder Bridge  [SB0402]  (value not drawn)
SB605  Solder Bridge  [SB0402]  (value not drawn)
SB606  Solder Bridge  [SB0402]  (value not drawn)
SB607  Solder Bridge  [SB0402]  (value not drawn)
SB608  Solder Bridge  [SB0402]  (value not drawn)
SB609  Solder Bridge  [SB0402]  (value not drawn)

### Blocks framed on the sheet
GPIO Level Shift: IC600

### Ports
AUX-ADC1 (out), AUX-ADC2 (out), IO-GPIO-1 (bidir), IO-GPIO-2 (bidir), IO-GPIO-3 (bidir), IO-GPIO-4 (bidir), IO-SBUS-RX (out), IO-SBUS-TX (in)

### Nets
3V3: D600.5(VDD) IC600.1(VCCA) IC600.12(OE) R600.2 SB600.2 SB602.2 SB604.2 SB606.2 SB608.2
+5: SB601.2 SB603.2 SB605.2 SB607.2 SB609.2
Analog-Supply: J600.20 J600.23 SB604.1 SB605.1
GPIO-LVL-Supply: IC600.11(VCCB) SB606.1 SB607.1
GPIO-Supply: J600.2 J600.5 J600.8 J600.11 SB602.1 SB603.1
PGND: D600.2(GND) IC600.6(GND) J600.3 J600.6 J600.9 J600.12 J600.15 J600.18 J600.21 J600.24 Q600.2(E) Q601.2(E)
SBUS-LVL-Supply: R601.2 SB608.1 SB609.1
SBUS-Supply: J600.14 J600.17 SB600.1 SB601.1
AUX-ADC1: D600.6(CH4) R608.1 ; port AUX-ADC1
AUX-ADC2: D600.4(CH3) R609.1 ; port AUX-ADC2
AUX-GPIO-1: IC600.10(B1) R604.1
AUX-GPIO-2: IC600.9(B2) R605.1
AUX-GPIO-3: IC600.8(B3) R606.1
AUX-GPIO-4: IC600.7(B4) R607.1
IO-GPIO-1: IC600.2(A1) ; port IO-GPIO-1
IO-GPIO-2: IC600.3(A2) ; port IO-GPIO-2
IO-GPIO-3: IC600.4(A3) ; port IO-GPIO-3
IO-GPIO-4: IC600.5(A4) ; port IO-GPIO-4
IO-SBUS-RX: Q601.3(C) R600.1 ; port IO-SBUS-RX
IO-SBUS-TX: R603.2 ; port IO-SBUS-TX
SBUS-RX: J600.16 R602.2
SBUS-TX: J600.13 Q600.3(C) R601.1
NetJ600_1: J600.1 R604.2
NetJ600_4: J600.4 R605.2
NetJ600_7: J600.7 R606.2
NetJ600_10: J600.10 R607.2
NetJ600_19: J600.19 R608.2
NetJ600_22: J600.22 R609.2
NetQ600_1: Q600.1(B) R603.1
NetQ601_1: Q601.1(B) R602.1

Not connected (* = marked no-connect by the designer): D600 1(CH1) 3(CH2)

### Notes on the sheet
- Title
- Size:
- Date:
- A4
- Number:
- Time:
- Revision:
- Sheet
- of
- File:

### Library data of the parts
D600 = ESDSUPPRESSOR: TVS Diode Array; Height: 0.6mm
IC600 = TXB0104RUTR: Integrated Circuit; pin to pad: 1>1+13; Manufacturer_Name: Texas Instruments; Datasheet Link: http://www.ti.com/lit/gpn/txb0104; Height: 0.55mm; Manufacturer_Part_Number: TXB0104RUTR; Mouser Part Number: 595-TXB0104RUTR; Mouser Price/Stock: https://www.mouser.co.uk/ProductDetail/Texas-Instruments/TXB0104RUTR?qs=EuM%2FBx4ov4Sspadi61aUCA%3D%3D; Arrow Part Number: TXB0104RUTR; Arrow Price/Stock: https://www.arrow.com/en/products/txb0104rutr/texas-instruments?region=nac
J600 = TSW-108-08-G-T-RA: Connector; Manufacturer_Name: SAMTEC; Datasheet Link: https://componentsearchengine.com/Datasheets/1/TSW-108-08-G-T-RA.pdf; Height: 8.12mm; Manufacturer_Part_Number: TSW-108-08-G-T-RA; Mouser Part Number: 200-TSW10808GTRA; Mouser Price/Stock: https://www.mouser.com/Search/Refine.aspx?Keyword=200-TSW10808GTRA
Q600 Q601 = BC847A,235: Transistor BJT NPN; Manufacturer_Name: Nexperia; Datasheet Link: http://assets.nexperia.com/documents/data-sheet/BC847_SER.pdf; Height: 1.1mm; Manufacturer_Part_Number: BC847A,235; Mouser Part Number: 771-BC847A235; Mouser Price/Stock: https://www.mouser.co.uk/ProductDetail/Nexperia/BC847A235?qs=me8TqzrmIYWeD%252BqPzufrRA%3D%3D; Arrow Part Number: BC847A,235; Arrow Price/Stock: https://www.arrow.com/en/products/bc847a235/nexperia
R600-R603 = R0603: Resistor; Height: 0.55mm
R604-R609 = R0402: Resistor; Height: 0.4mm
SB600-SB609 = Solder Bridge: Internal_Part_Number: MCD-00071; Part_Type: Mechanical; Manufacturer_Part_Number: RC0603JR-070RL; Manufacturer: YAGEO; Provided_By: SUBCO; ECCN_US: n/a; ECCN_EU: n/a; Status: Released; Package: SB0603; ComponentLink1Description: Datasheet; ComponentLink1URL: http://tunmcdsvn.tun.st.com/Component_Datasheet_Library/Trunk/Resistors/Yageo_Resistor_RC0603-series

## Nets that join several sheets
3V3: modFOC-IO (9 pins), modFOC-MCU (16 pins), modFOC-Buck-Supply (C106.2 IC101.2,4), modFOC-Debug (C200.2 D200.5 J200.1), modFOC-ESC-Interface (D500.5 D501.5), modFOC-RC-Interface (9 pins)
+5: modFOC-IO (D300.1), modFOC-Buck-Supply (8 pins), modFOC-ESC-Interface (J500.10 J502.1), modFOC-RC-Interface (5 pins)
PGND: modFOC-IO (10 pins), modFOC-MCU (23 pins), modFOC-Buck-Supply (15 pins), modFOC-Debug (8 pins), modFOC-ESC-Interface (6 pins), modFOC-RC-Interface (12 pins)
AUX-ADC1: modFOC-MCU (C402.2 IC400.12), modFOC-RC-Interface (D600.6 R608.1)
AUX-ADC2: modFOC-MCU (C401.2 IC400.13), modFOC-RC-Interface (D600.4 R609.1)
CS_0: modFOC-MCU (IC400.14), modFOC-ESC-Interface (D501.4 R503.1)
CS_1: modFOC-MCU (IC400.17), modFOC-ESC-Interface (D501.6 R504.1)
CS_2: modFOC-MCU (IC400.18), modFOC-ESC-Interface (D501.1 R505.1)
CS_HRange: modFOC-MCU (IC400.22), modFOC-ESC-Interface (D501.3 R506.1)
DEBUG-LED1: modFOC-MCU (IC400.42), modFOC-Debug (R207.1)
DEBUG-LED2: modFOC-MCU (IC400.41), modFOC-Debug (R206.1)
DEBUG-LED3: modFOC-MCU (IC400.40), modFOC-Debug (R205.1)
IO-GPIO-1: modFOC-MCU (IC400.37), modFOC-RC-Interface (IC600.2)
IO-GPIO-2: modFOC-MCU (IC400.36), modFOC-RC-Interface (IC600.3)
IO-GPIO-3: modFOC-MCU (IC400.35), modFOC-RC-Interface (IC600.4)
IO-GPIO-4: modFOC-MCU (IC400.34), modFOC-RC-Interface (IC600.5)
IO-I2C-SCL: modFOC-IO (D304.3 R309.1 R314.2), modFOC-MCU (IC400.38)
IO-I2C-SDA: modFOC-IO (D304.1 R310.1 R313.2), modFOC-MCU (IC400.39)
IO-SBUS-RX: modFOC-MCU (IC400.33), modFOC-RC-Interface (Q601.3 R600.1)
IO-SBUS-TX: modFOC-MCU (IC400.30), modFOC-RC-Interface (R603.2)
IO-SPI-MISO: modFOC-IO (D301.1 R301.1), modFOC-MCU (IC400.53)
IO-SPI-MOSI: modFOC-IO (D301.3 R300.1), modFOC-MCU (IC400.54)
IO-SPI-NCS: modFOC-IO (D301.4 R303.1), modFOC-MCU (IC400.51)
IO-SPI-SCL: modFOC-IO (D301.6 R302.1), modFOC-MCU (IC400.52)
IO-UART-RX: modFOC-IO (D304.6 R306.1), modFOC-MCU (IC400.44)
IO-UART-TX: modFOC-IO (D304.4 R305.1), modFOC-MCU (IC400.43)
MISO_H: modFOC-MCU (IC400.20), modFOC-ESC-Interface (D500.1 R501.1)
MOSI_H: modFOC-MCU (IC400.21), modFOC-ESC-Interface (D500.6 R502.1)
NetD200_1: modFOC-MCU (IC400.49), modFOC-Debug (D200.1 R200.2)
NetD200_3: modFOC-MCU (IC400.50), modFOC-Debug (D200.3 R201.2)
NetD200_4: modFOC-MCU (IC400.56), modFOC-Debug (D200.4 R202.2)
NetIC300_4: modFOC-IO (IC300.4), modFOC-MCU (IC400.46)
NetIC300_6: modFOC-IO (IC300.6), modFOC-MCU (IC400.45)
SCLK_H: modFOC-MCU (IC400.19), modFOC-ESC-Interface (D500.4 R500.1)
SWD.NRESET: modFOC-MCU (C400.1 IC400.7 R400.2 S400.2,3), modFOC-Debug (D200.6 R203.2)